# EAGLE design ISPnubMod (EAGLE 7.7.0)
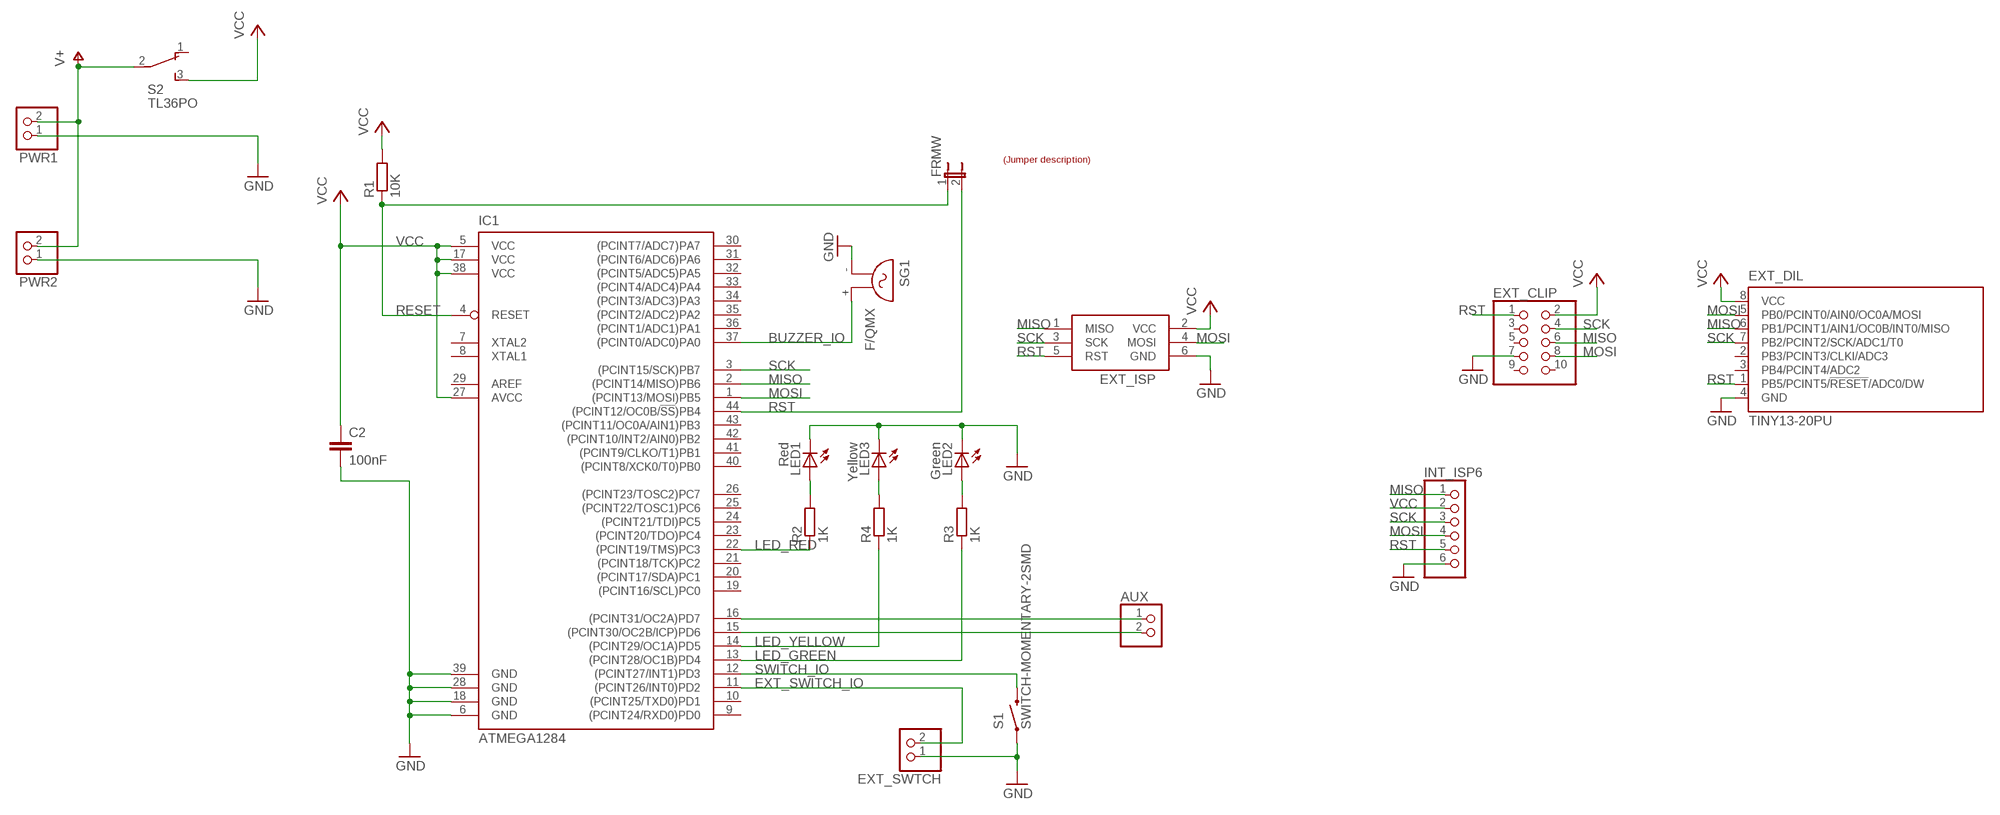
[diagram p0: schematic, sheet 1]

## Parts
AUX  PINHD-1X2  [1X02]
C2  100nF  C-EUC0805  [C0805]
EXT_CLIP  PINHD-2X5  [2X05]
EXT_DIL  TINY13-20PU  [DIL08]
EXT_ISP  AVRISP-6  [AVRISP]
EXT_SWTCH  PINHD-1X2  [1X02]
FRMW  JP1E  [JP1]
IC1  ATMEGA1284  ATMEGA644A  [TQFP44]
INT_ISP6  PINHD-1X6  [1X06]
LED1  Red  LEDCHIP-LED0805  [CHIP-LED0805]
LED2  Green  LEDCHIP-LED0805  [CHIP-LED0805]
LED3  Yellow  LEDCHIP-LED0805  [CHIP-LED0805]
PWR1  PINHD-1X2  [1X02]
PWR2  PINHD-1X2  [1X02]
R1  10K  R-EU_R0805  [R0805]
R2  1K  R-EU_R0805  [R0805]
R3  1K  R-EU_R0805  [R0805]
R4  1K  R-EU_R0805  [R0805]
S1  SWITCH-MOMENTARY-2SMD  [TACTILE_SWITCH_SMD]
S2  TL36PO  [TL3XPO]
SG1  F/QMX  [F/QMX]
U$1  LABEL_JUMPER_1X2  [JUMP2_DESC]

## Nets
BUZZER_IO: IC1.37((PCINT0/ADC0)PA0) SG1.+
EXT_SWITCH_IO: EXT_SWTCH.2 IC1.11((PCINT26/INT0)PD2)
GND: C2.2 EXT_CLIP.7 EXT_DIL.4(GND) EXT_ISP.6(GND) EXT_SWTCH.1 IC1.6(GND) IC1.18(GND) IC1.28(GND) IC1.39(GND) INT_ISP6.6 LED1.C LED2.C LED3.C PWR1.1 PWR2.1 S1.1 SG1.-
LED_GREEN: IC1.13((PCINT28/OC1B)PD4) R3.1
LED_RED: IC1.22((PCINT19/TMS)PC3) R2.1
LED_YELLOW: IC1.14((PCINT29/OC1A)PD5) R4.1
MISO: EXT_CLIP.6 EXT_DIL.6(PB1/PCINT1/AIN1/OC0B/INT0/MISO) EXT_ISP.1(MISO) IC1.2((PCINT14/MISO)PB6) INT_ISP6.1
MOSI: EXT_CLIP.8 EXT_DIL.5(PB0/PCINT0/AIN0/OC0A/MOSI) EXT_ISP.4(MOSI) IC1.1((PCINT13/MOSI)PB5) INT_ISP6.4
N$1: LED1.A R2.2
N$2: LED2.A R3.2
N$4: LED3.A R4.2
PD6: AUX.2 IC1.15((PCINT30/OC2B/ICP)PD6)
PD7: AUX.1 IC1.16((PCINT31/OC2A)PD7)
RESET: FRMW.1 IC1.4(RESET) R1.1
RST: EXT_CLIP.1 EXT_DIL.1(PB5/PCINT5/!RESET!/ADC0/DW) EXT_ISP.5(RST) FRMW.2 IC1.44((PCINT12/OC0B/!SS!)PB4) INT_ISP6.5
SCK: EXT_CLIP.4 EXT_DIL.7(PB2/PCINT2/SCK/ADC1/T0) EXT_ISP.3(SCK) IC1.3((PCINT15/SCK)PB7) INT_ISP6.3
SWITCH_IO: IC1.12((PCINT27/INT1)PD3) S1.3
V+: PWR1.2 PWR2.2 S2.2(P)
VCC: C2.1 EXT_CLIP.2 EXT_DIL.8(VCC) EXT_ISP.2(VCC) IC1.5(VCC) IC1.17(VCC) IC1.27(AVCC) IC1.38(VCC) INT_ISP6.2 R1.2 S2.3(S)
Unconnected: EXT_CLIP.3 EXT_CLIP.5 EXT_CLIP.9 EXT_CLIP.10 EXT_DIL.2(PB3/PCINT3/CLKI/ADC3) EXT_DIL.3(PB4/PCINT4/ADC2) IC1.7(XTAL2) IC1.8(XTAL1) IC1.9((PCINT24/RXD0)PD0) IC1.10((PCINT25/TXD0)PD1) IC1.19((PCINT16/SCL)PC0) IC1.20((PCINT17/SDA)PC1) IC1.21((PCINT18/TCK)PC2) IC1.23((PCINT20/TDO)PC4) IC1.24((PCINT21/TDI)PC5) IC1.25((PCINT22/TOSC1)PC6) IC1.26((PCINT23/TOSC2)PC7) IC1.29(AREF) IC1.30((PCINT7/ADC7)PA7) IC1.31((PCINT6/ADC6)PA6) IC1.32((PCINT5/ADC5)PA5) IC1.33((PCINT4/ADC4)PA4) IC1.34((PCINT3/ADC3)PA3) IC1.35((PCINT2/ADC2)PA2) IC1.36((PCINT1/ADC1)PA1) IC1.40((PCINT8/XCK0/T0)PB0) IC1.41((PCINT9/CLKO/T1)PB1) IC1.42((PCINT10/INT2/AIN0)PB2) IC1.43((PCINT11/OC0A/AIN1)PB3) S2.1(O)

## Library data of the parts
AUX EXT_SWTCH PWR1 PWR2 = pinhead:PINHD-1X2: PIN HEADER
C2 = rcl:C-EU: CAPACITOR, European symbol; MOUSER#: 80-C0805C104K5R
EXT_CLIP = pinhead:PINHD-2X5: PIN HEADER
EXT_DIL = atmel:TINY13: 8-bit AVR Microcontroller with 1K Bytes In-System Programmable Flash Source: http://www.atmel.com/dyn/resources/prod_documents/2535S.pdf; MPN: ATTINY13-20PU; OC_FARNELL: 9171550; OC_NEWARK: 96K6521
EXT_ISP = adafruit:AVRISP: AVR ISP HEADER Standard 6 pin header for AVR programming
FRMW = jumper:JP1E: JUMPER; MOUSER#: 571-826936-2
IC1 = atmel:ATMEGA644: 8-bit Microcontroller with 64K Bytes In-System Programmable Flash Source: http://www.atmel.com/dyn/resources/prod_documents/doc2593.pdf; MOUSER#: 556-ATMEGA1284P-AU; MPN: ATMEGA1284PV-10AU; OC_FARNELL: 1455123; OC_NEWARK: 58M3748
INT_ISP6 = pinhead:PINHD-1X6: PIN HEADER
LED1 = led:LED: LED OSRAM: - CHIPLED LG R971, LG N971, LY N971, LG Q971, LY Q971, LO R971, LY R971 LH N974, LH R974 LS Q976, LO Q976, LY Q976 LO Q996 - Hyper CHIPLED LW Q18S LB Q993, LB Q99A, LB R99A - SideLED LS A670, LO A670, LY A670, LG A670, LP A670 LB A673, LV A673, LT A673, LW A673 LH A674 LY A675 LS A676, LA A676, LO A676, LY A676, LW A676 LS A679, LY A679, LG A679 - Hyper Micro SIDELED® LS Y876, LA Y876, LO Y876, LY Y876 LT Y87S - SmartLED LW L88C, LW L88S LB L89C, LB L89S, LG L890 LS L89K, LO L89K, LY L89K LS L896, LA L896, LO L896, LY L896 - TOPLED LS T670, LO T670, LY T670, LG T670, LP T670 LSG T670, LSP T670, LSY T670, LOP T670, LYG T670 LG T671, LOG T671, LSG T671 LB T673, LV T673, LT T673, LW T673 LH T674 LS T676, LA T676, LO T676, LY T676, LB T676, LH T676, LSB T676, LW T676 LB T67C, LV T67C, LT T67C, LS T67K, LO T67K, LY T67K, LW E67C LS E67B, LA E67B, LO E67B, LY E67B, LB E67C, LV E67C, LT E67C LW T67C LS T679, LY T679, LG T679 LS T770, LO T770, LY T770, LG T770, LP T770 LB T773, LV T773, LT T773, LW T773 LH T774 LS E675, LA E675, LY E675, LS T675 LS T776, LA T776, LO T776, LY T776, LB T776 LHGB T686 LT T68C, LB T68C - Hyper Mini TOPLED® LB M676 - Mini TOPLED Santana® LG M470 LS M47K, LO M47K, LY M47K Source: http://www.osram.convergy.de LUXEON: - LUMILED® LXK2-PW12-R00, LXK2-PW12-S00, LXK2-PW14-U00, LXK2-PW14-V00 LXK2-PM12-R00, LXK2-PM12-S00, LXK2-PM14-U00 LXK2-PE12-Q00, LXK2-PE12-R00, LXK2-PE12-S00, LXK2-PE14-T00, LXK2-PE14-U00 LXK2-PB12-K00, LXK2-PB12-L00, LXK2-PB12-M00, LXK2-PB14-N00, LXK2-PB14-P00, LXK2-PB14-Q00 LXK2-PR12-L00, LXK2-PR12-M00, LXK2-PR14-Q00, LXK2-PR14-R00 LXK2-PD12-Q00, LXK2-PD12-R00, LXK2-PD12-S00 LXK2-PH12-R00, LXK2-PH12-S00 LXK2-PL12-P00, LXK2-PL12-Q00, LXK2-PL12-R00 Source: www.luxeon.com KINGBRIGHT: KA-3528ASYC Source: www.kingbright.com; MOUSER#: 604-APT1608SURC
LED2 LED3 = led:LED: LED OSRAM: - CHIPLED LG R971, LG N971, LY N971, LG Q971, LY Q971, LO R971, LY R971 LH N974, LH R974 LS Q976, LO Q976, LY Q976 LO Q996 - Hyper CHIPLED LW Q18S LB Q993, LB Q99A, LB R99A - SideLED LS A670, LO A670, LY A670, LG A670, LP A670 LB A673, LV A673, LT A673, LW A673 LH A674 LY A675 LS A676, LA A676, LO A676, LY A676, LW A676 LS A679, LY A679, LG A679 - Hyper Micro SIDELED® LS Y876, LA Y876, LO Y876, LY Y876 LT Y87S - SmartLED LW L88C, LW L88S LB L89C, LB L89S, LG L890 LS L89K, LO L89K, LY L89K LS L896, LA L896, LO L896, LY L896 - TOPLED LS T670, LO T670, LY T670, LG T670, LP T670 LSG T670, LSP T670, LSY T670, LOP T670, LYG T670 LG T671, LOG T671, LSG T671 LB T673, LV T673, LT T673, LW T673 LH T674 LS T676, LA T676, LO T676, LY T676, LB T676, LH T676, LSB T676, LW T676 LB T67C, LV T67C, LT T67C, LS T67K, LO T67K, LY T67K, LW E67C LS E67B, LA E67B, LO E67B, LY E67B, LB E67C, LV E67C, LT E67C LW T67C LS T679, LY T679, LG T679 LS T770, LO T770, LY T770, LG T770, LP T770 LB T773, LV T773, LT T773, LW T773 LH T774 LS E675, LA E675, LY E675, LS T675 LS T776, LA T776, LO T776, LY T776, LB T776 LHGB T686 LT T68C, LB T68C - Hyper Mini TOPLED® LB M676 - Mini TOPLED Santana® LG M470 LS M47K, LO M47K, LY M47K Source: http://www.osram.convergy.de LUXEON: - LUMILED® LXK2-PW12-R00, LXK2-PW12-S00, LXK2-PW14-U00, LXK2-PW14-V00 LXK2-PM12-R00, LXK2-PM12-S00, LXK2-PM14-U00 LXK2-PE12-Q00, LXK2-PE12-R00, LXK2-PE12-S00, LXK2-PE14-T00, LXK2-PE14-U00 LXK2-PB12-K00, LXK2-PB12-L00, LXK2-PB12-M00, LXK2-PB14-N00, LXK2-PB14-P00, LXK2-PB14-Q00 LXK2-PR12-L00, LXK2-PR12-M00, LXK2-PR14-Q00, LXK2-PR14-R00 LXK2-PD12-Q00, LXK2-PD12-R00, LXK2-PD12-S00 LXK2-PH12-R00, LXK2-PH12-S00 LXK2-PL12-P00, LXK2-PL12-Q00, LXK2-PL12-R00 Source: www.luxeon.com KINGBRIGHT: KA-3528ASYC Source: www.kingbright.com; MOUSER#: 604-APT2012SGC
R1 = rcl:R-EU_: RESISTOR, European symbol; MOUSER#: 603-SR0805JR-0710KL
R2-R4 = rcl:R-EU_: RESISTOR, European symbol; MOUSER#: 71-CRCW0805-1.0K-E3
S1 = Arduino-Pro-Mini-v14Arduino-Pro-Mini:SWITCH-MOMENTARY-2: Various NO switches- pushbuttons, reed, etc; MOUSER#: 693-1301.9314; PROD_ID: SWCH-08247
S2 = switch:TL36PO: TINY SWITCH ON - ON Source: http://www2.produktinfo.conrad.com/datenblaetter/700000-724999/705152-da-01-de-Subminiaturschalter_TL_36YO.pdf
SG1 = buzzer:F/QMX: BUZZER Source: Buerklin; OC_FARNELL: unknown; OC_NEWARK: unknown
U$1 = dp_devices:LABEL_JUMPER_1X2: Nice formatted two legged jumperdescription Use attributes to change the values ON = With jumper OFF = Without jumper; OFF: Normal; ON: Update Firmware

## Net classes
0 default: width 0.3 mm

## Board
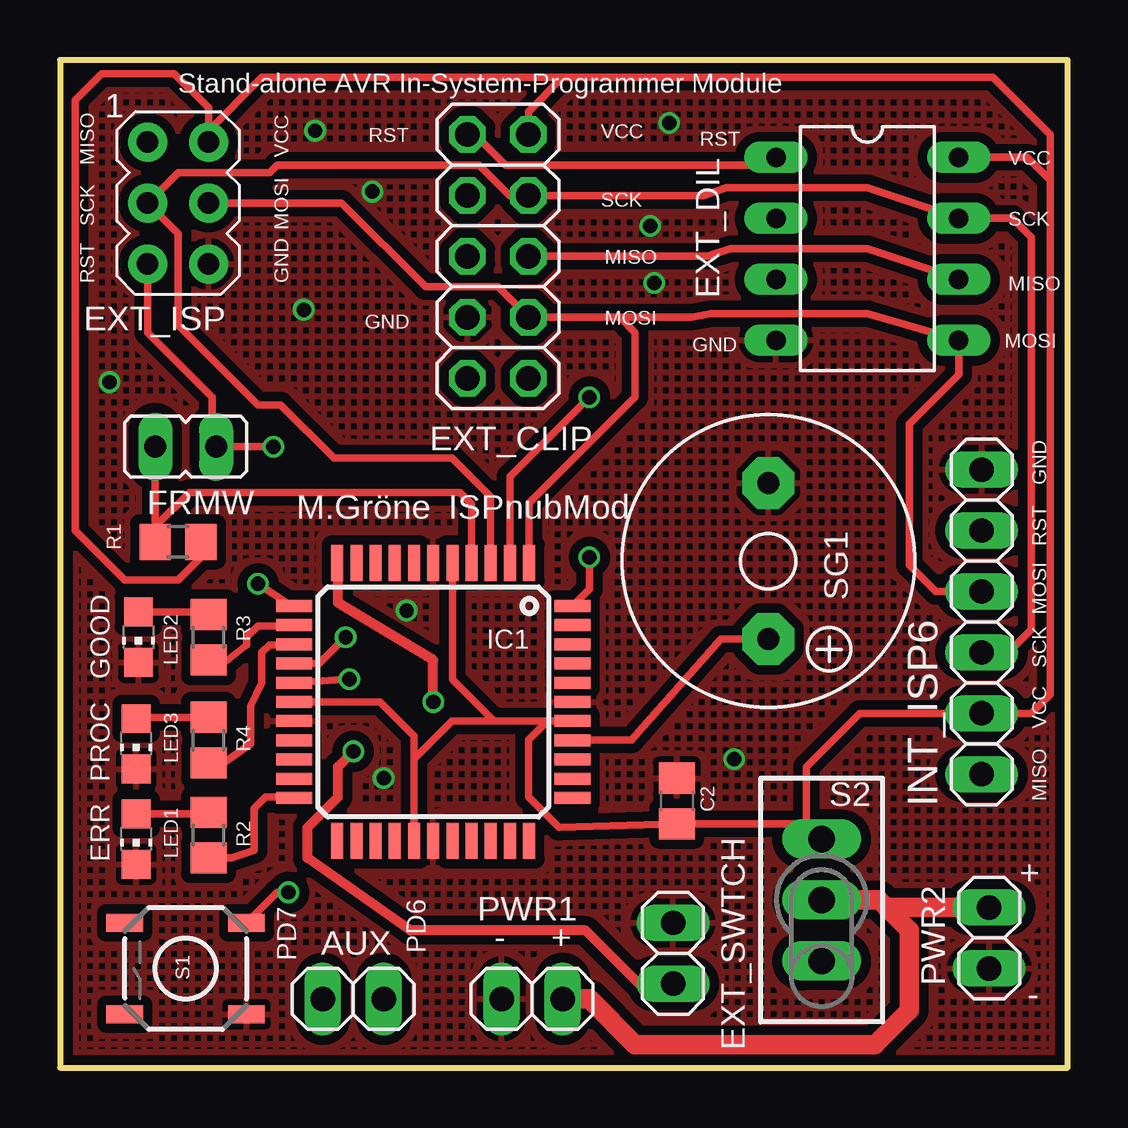
[diagram p1: board, top side]
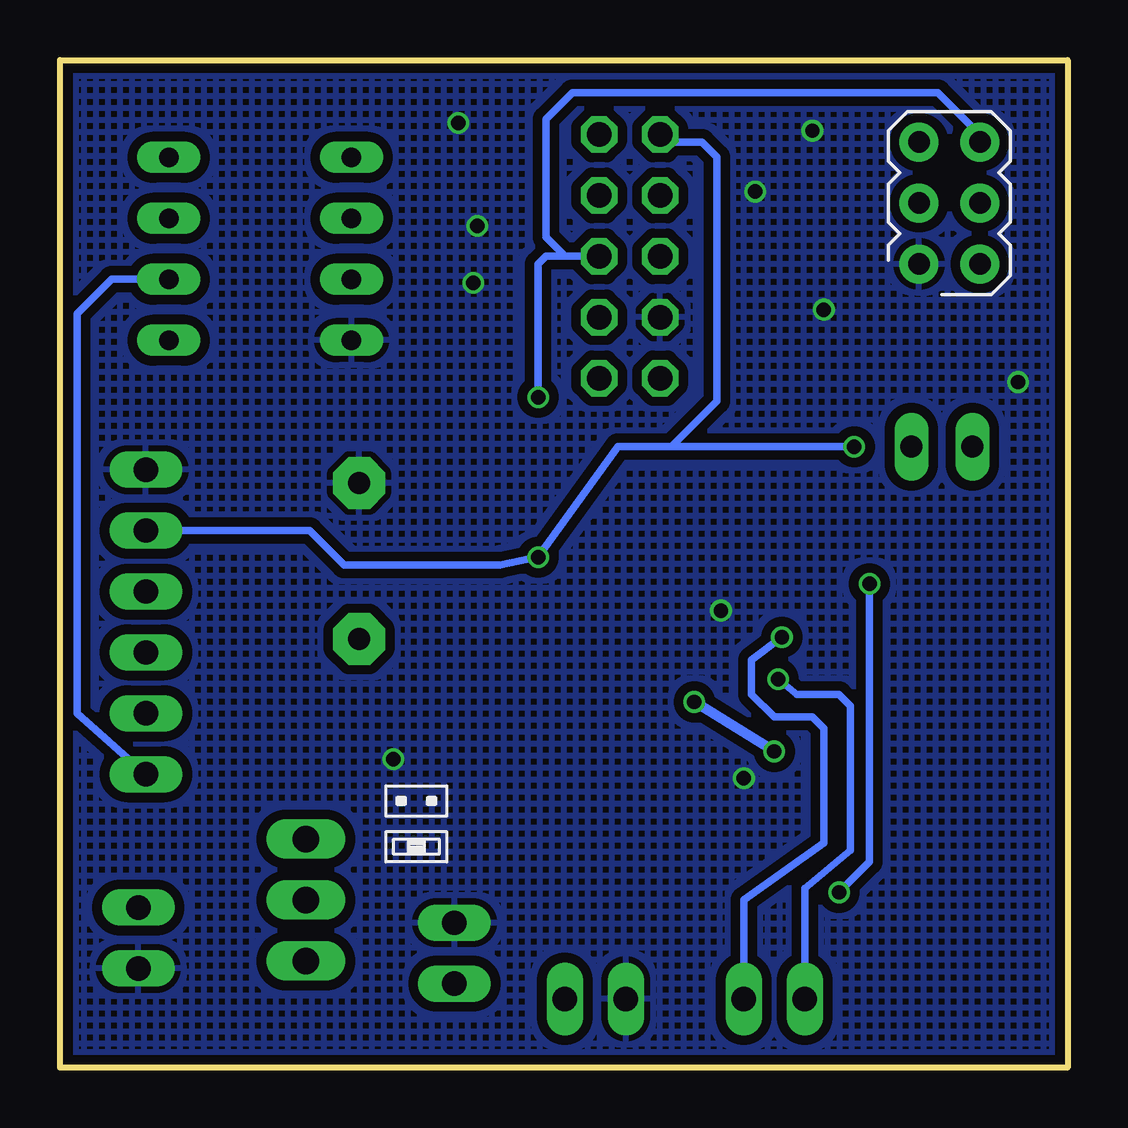
[diagram p2: board, bottom side, seen from below]

Size 42 x 42 mm. Coordinates in mm from the lower left corner, seen from the top.
Outline: 0,0 42,0 42,42 0,42 0,0
Copper layers (1*16): Top 0.035mm / dielectric 1.5mm / Bottom 0.035mm
Design rules "Elecrow_2-layer_eagle_rule": minimum track width 6mil, minimum drill 12mil, track to track 6mil, track to pad 6mil, pad to pad 6mil, via to via 6mil, smd to smd 0mil, copper to edge 10mil, drill to drill 10mil, minimum pad ring 10mil, minimum via ring 6mil, stop-mask expansion 2mil, vias tented up to drill 100mil, thermal gap 10mil

### Footprints (pad centres in the part's own frame; a part is rotated, then mirrored left to right if it is on the bottom)
1X02 = drill 1.016 long: 1 -1.27,0; 2 1.27,0
C0805 = smd 1.3 x 1.5: 1 -0.95,0; 2 0.95,0
2X05 = drill 1.016 octagon: 1 -5.08,-1.27; 2 -5.08,1.27; 3 -2.54,-1.27; 4 -2.54,1.27; 5 0,-1.27; 6 0,1.27; 7 2.54,-1.27; 8 2.54,1.27; 9 5.08,-1.27; 10 5.08,1.27
DIL08 = drill 0.813 long: 1 -3.81,-3.81; 2 -1.27,-3.81; 3 1.27,-3.81; 4 3.81,-3.81; 5 3.81,3.81; 6 1.27,3.81; 7 -1.27,3.81; 8 -3.81,3.81
AVRISP = drill 0.9 pad 1.626: 1 -1.27,2.54; 2 1.27,2.54; 3 -1.27,0; 4 1.27,0; 5 -1.27,-2.54; 6 1.27,-2.54
JP1 = drill 0.914 long: 1 0,-1.27; 2 0,1.27
TQFP44 = smd 1.5 x 0.5: 1 -5.8,4; 2 -5.8,3.2; 3 -5.8,2.4; 4 -5.8,1.6; 5 -5.8,0.8; 6 -5.8,0; 7 -5.8,-0.8; 8 -5.8,-1.6; 9 -5.8,-2.4; 10 -5.8,-3.2; 11 -5.8,-4; 23 5.8,-4; 24 5.8,-3.2; 25 5.8,-2.4; 26 5.8,-1.6; 27 5.8,-0.8; 28 5.8,0; 29 5.8,0.8; 30 5.8,1.6; 31 5.8,2.4; 32 5.8,3.2; 33 5.8,4 | smd 0.5 x 1.5: 12 -4,-5.8; 13 -3.2,-5.8; 14 -2.4,-5.8; 15 -1.6,-5.8; 16 -0.8,-5.8; 17 0,-5.8; 18 0.8,-5.8; 19 1.6,-5.8; 20 2.4,-5.8; 21 3.2,-5.8; 22 4,-5.8; 34 4,5.8; 35 3.2,5.8; 36 2.4,5.8; 37 1.6,5.8; 38 0.8,5.8; 39 0,5.8; 40 -0.8,5.8; 41 -1.6,5.8; 42 -2.4,5.8; 43 -3.2,5.8; 44 -4,5.8
1X06 = drill 1.016 long: 1 -6.35,0; 2 -3.81,0; 3 -1.27,0; 4 1.27,0; 5 3.81,0; 6 6.35,0
CHIP-LED0805 = smd 1.2 x 1.2: A 0,-1.05; C 0,1.05
R0805 = smd 1.3 x 1.5: 1 -0.95,0; 2 0.95,0
TACTILE_SWITCH_SMD = smd 1.524 x 0.762: 1 -2.54,1.905; 2 2.54,1.905; 3 -2.54,-1.905; 4 2.54,-1.905
TL3XPO = drill 1.1 pad 1.422 long: 1 -2.54,0; 2 0,0; 3 2.54,0
F/QMX = drill 0.914 pad 2.159 octagon: + 3.251,0; - -3.251,0

### Placement (x,y rotation side)
AUX  12.22,2.86 0 top
C2  25.72,11.11 90 top
EXT_CLIP  18.26,33.81 270 top
EXT_DIL  33.66,34.13 270 top
EXT_ISP  4.92,36.04 0 top
EXT_SWTCH  25.56,4.76 270 top
FRMW  5.24,25.88 270 top
IC1  15.56,15.24 270 top
INT_ISP6  38.42,18.57 90 top
LED1  3.17,9.53 180 top
LED2  3.27,17.94 180 top
LED3  3.17,13.49 180 top
PWR1  19.68,2.86 0 top
PWR2  38.73,5.4 90 top
R1  4.92,21.91 0 top
R2  6.19,9.68 90 top
R3  6.19,17.94 90 top
R4  6.19,13.65 90 top
S1  5.24,4.13 180 top
S2  31.75,6.99 90 top
SG1  29.53,21.11 270 top
U$1  24.61,9.84 0 bottom

### Tracks (layer width: path | path; a pad name or v marks a point on that pad's centre or on a via)
BUZZER_IO
  Top 0.305: IC1.37 21.37,13.65 23.81,13.65 27.55,17.86 SG1.+
EXT_SWITCH_IO  (via drill 0.6)
  Top 0.406: EXT_SWTCH.2 24.13,3.49 21.91,5.71 14.61,5.71 10.32,8.73 10.32,10 11.59,11.27 11.59,12.54 v12.22,13.18 | v15.56,15.24 15.56,16.99 11.59,19.37 11.59,21.01 IC1.11
  Bottom 0.406: v12.22,13.18 v15.56,15.24
GND  (via drill 0.6)
  other vias: 14.45,19.05 13.49,12.06 25.4,39.37 10.16,31.59 2.06,28.57 13.02,36.51 10.64,39.05 24.61,35.08 24.77,32.7 28.1,12.86
  pour Top (isolate 0.4, hatched): 0,0 42,0 42,42 0,42
  pour Bottom (isolate 0.4, hatched): 0,0 42,0 42,42 0,42
LED_GREEN
  Top 0.305: R3.1 6.99,16.99 7.78,17.62 7.78,17.94 8.26,18.41 9.73,18.41 IC1.13
LED_RED
  Top 0.305: R2.1 7.15,8.73 8.1,9.05 8.1,10.79 8.57,11.27 9.73,11.27 IC1.22
LED_YELLOW
  Top 0.305: R4.1 6.83,12.7 7.94,13.49 7.94,15.08 8.41,16.03 8.41,17.3 8.73,17.62 9.74,17.62 IC1.14
MISO  (via drill 0.6)
  Top 0.305: EXT_CLIP.6 26.99,33.81 27.94,34.13 33.66,34.13 EXT_DIL.6 | IC1.2 18.76,24.63 v22.07,27.94
  Bottom 0.305: EXT_ISP.1 3.65,38.89 5.4,40.64 20.64,40.64 21.75,39.53 21.75,34.61 20.95,33.81 EXT_CLIP.6 21.75,33.81 22.07,33.5 v22.07,27.94 | EXT_DIL.6 39.85,32.86 41.27,31.43 41.27,14.76 INT_ISP6.1
MOSI
  Top 0.305: 23.34,31.27 EXT_CLIP.8 18.26,32.54 15.24,32.54 11.75,36.04 EXT_ISP.4 | 23.34,31.27 26.35,31.27 27.15,31.43 33.66,31.43 EXT_DIL.5 37.47,28.89 35.4,26.83 35.4,20.95 36.51,19.84 INT_ISP6.4 | IC1.1 19.56,23.53 23.97,27.94 23.97,30.64 23.34,31.27
N$1
  Top 0.305: LED1.A 6.13,10.57 R2.2
N$2
  Top 0.305: LED2.A 6.09,18.99 R3.2
N$4
  Top 0.305: R4.2 3.23,14.6 LED3.A
PD6  (via drill 0.6)
  Top 0.305: IC1.15 10.81,16.84 v11.91,17.94
  Bottom 0.305: v11.91,17.94 13.18,16.99 13.18,15.56 12.22,14.61 10.64,14.61 10.16,14.13 10.16,9.37 13.49,6.99 AUX.2
PD7  (via drill 0.6)
  Top 0.305: IC1.16 v12.06,16.19
  Bottom 0.305: v12.06,16.19 11.27,15.56 9.53,15.56 9.05,15.08 9.05,9.05 10.95,7.46 AUX.1
RESET
  Top 0.305: R1.1 3.97,22.54 | 3.97,22.54 FRMW.1 | IC1.4 17.16,23.48 16.67,23.97 5.4,23.97 3.97,22.54
RST  (via drill 0.6)
  Top 0.305: v8.89,25.88 FRMW.2 6.35,26.04 6.35,27.94 3.65,30.64 EXT_ISP.5 | v22.07,21.27 22.07,19.95 IC1.44 | EXT_CLIP.1 17.3,38.89 18.57,37.62 29.53,37.62 EXT_DIL.1
  Bottom 0.305: v8.89,25.88 16.51,25.88 | INT_ISP6.5 31.59,22.38 30.16,20.95 23.65,20.95 v22.07,21.27 18.73,25.88 16.51,25.88 | 16.51,25.88 14.61,27.78 14.61,37.94 15.24,38.58 16.67,38.58 EXT_CLIP.1
SCK
  Top 0.305: IC1.3 17.96,23.79 16.35,25.4 11.43,25.4 9.21,27.62 8.26,27.62 4.92,30.96 4.92,34.77 EXT_ISP.3 4.92,37.31 8.73,37.31 9.05,37.62 17.46,37.62 18.73,36.35 EXT_CLIP.4 26.83,36.35 27.78,36.67 33.66,36.67 EXT_DIL.7 39.69,35.4 40.48,34.61 40.48,18.26 39.69,17.46 38.89,17.46 INT_ISP6.3
SWITCH_IO  (via drill 0.6)
  Top 0.305: IC1.12 9.65,19.24 v8.26,20.16 | v9.53,7.3 9.05,7.3 S1.3
  Bottom 0.305: v8.26,20.16 8.26,8.57 v9.53,7.3
V+
  Top 0.813: PWR1.2 22.07,2.86 23.97,0.95 33.97,0.95 35.4,2.38 35.4,5.71 34.45,6.67 | S2.2 34.13,6.99 34.45,6.67 | PWR2.2 34.45,6.67
VCC
  Top 0.305: IC1.27 14.76,12.86 | 14.76,12.86 14.76,13.82 13.34,15.24 IC1.17 | 18.1,14.44 IC1.38 20.31,14.44 19.53,13.65 19.53,11.27 20.8,10 C2.1 31.11,10.16 | 18.1,14.44 16.34,14.44 14.76,12.86 | IC1.5 16.36,16.18 18.1,14.44 | 31.11,10.16 S2.3 | 31.11,10.16 31.11,12.54 33.34,14.76 INT_ISP6.2 40.48,14.76 41.27,15.56 41.27,36.99 | R1.2 5.87,21.27 4.92,20.32 2.7,20.32 0.64,22.38 0.64,40.32 1.75,41.43 4.76,41.43 6.19,40.01 EXT_ISP.2 6.19,39.05 8.41,41.27 20.95,41.27 | EXT_DIL.8 40.32,37.94 41.27,36.99 | EXT_CLIP.2 19.53,39.85 20.95,41.27 | 20.95,41.27 38.89,41.27 41.27,38.89 41.27,36.99

### Text on the board
tPlace: PD6 | PD7
tNames: Stand-alone AVR In-System-Programmer Module | RST | VCC | MISO | VCC | RST | VCC | SCK | SCK | MOSI | SCK | RST | GND | MISO | MISO | GND | MOSI | GND | MOSI | GND | M.Gröne | ISPnubMod | RST | MOSI | SCK | GOOD | VCC | PROC | MISO | ERR | + | - | + | -